# EAGLE design 2CH_Edgemount_POT (EAGLE 6.6.0)
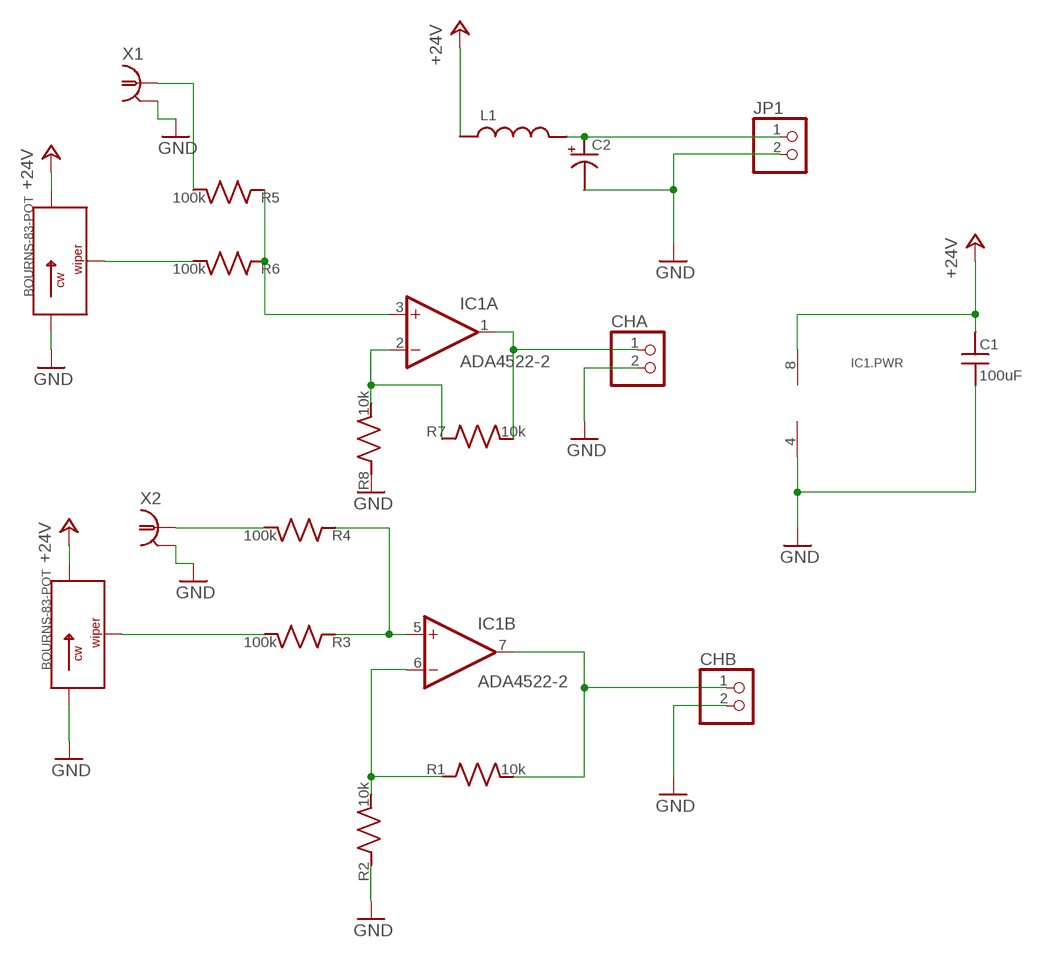
[diagram p0: schematic, sheet 1]

## Parts
C1  100uF  C_MLCC_SMDCMLCC_0603  [C_MLCC_0603]
C2  C_POL_SMDF  [PANASONIC_F]
CHA  PINHD-1X2  [1X02]
CHB  PINHD-1X2  [1X02]
IC1  ADA4522-2  [SO08]
JP1  PINHD-1X2  [1X02]
L1  L_FERRITE_SMDLFERRITE_0805  [R_0805]
R1  10k  R_SMDR1206  [R_1206]
R2  10k  R_SMDR1206  [R_1206]
R3  100k  R_SMDR1206  [R_1206]
R4  100k  R_SMDR1206  [R_1206]
R5  100k  R_SMDR1206  [R_1206]
R6  100k  R_SMDR1206  [R_1206]
R7  10k  R_SMDR1206  [R_1206]
R8  10k  R_SMDR1206  [R_1206]
R9  BOURNS-83-POT  [BOURNS83]
R10  BOURNS-83-POT  [BOURNS83]
X1  BNC-H  [BNC90]
X2  BNC-H  [BNC90]

## Nets
+24V: C1.P$1 IC1.8(.PWR:V+) L1.P$1 R9.P$3 R10.P$3
CHB: CHB.1 IC1.7(B:OUT) R1.P$2
GND: C1.P$2 C2.- CHA.2 CHB.2 IC1.4(.PWR:V-) JP1.2 R2.P$1 R8.P$1 R9.P$1 R10.P$1 X1.2 X2.2
N$1: R6.P$2 R9.P$2
N$2: R3.P$2 R10.P$2
N$3: IC1.6(B:-IN) R1.P$1 R2.P$2
N$4: IC1.5(B:+IN) R3.P$1 R4.P$1
N$5: IC1.2(A:-IN) R7.P$1 R8.P$2
N$6: CHA.1 IC1.1(A:OUT) R7.P$2
N$7: IC1.3(A:+IN) R5.P$1 R6.P$1
N$8: R4.P$2 X2.1
N$9: R5.P$2 X1.1
N$10: C2.+ JP1.1 L1.P$2

## Library data of the parts
C1 = jqi_passives:C_MLCC_SMD
C2 = jqi_passives:C_POL_SMD
CHA CHB JP1 = pinhead:PINHD-1X2: PIN HEADER
IC1 = opamp-jqi:ADA4522-2: 55V ultralow noise op amp
L1 = jqi_passives:L_FERRITE_SMD
R1-R8 = jqi_passives:R_SMD
R9 R10 = jqi_passives:BOURNS-83-POT: Through-hole POT
X1 X2 = connector-jqi:BNC: BNC Connector.; DIGIKEY: 12345

## Board
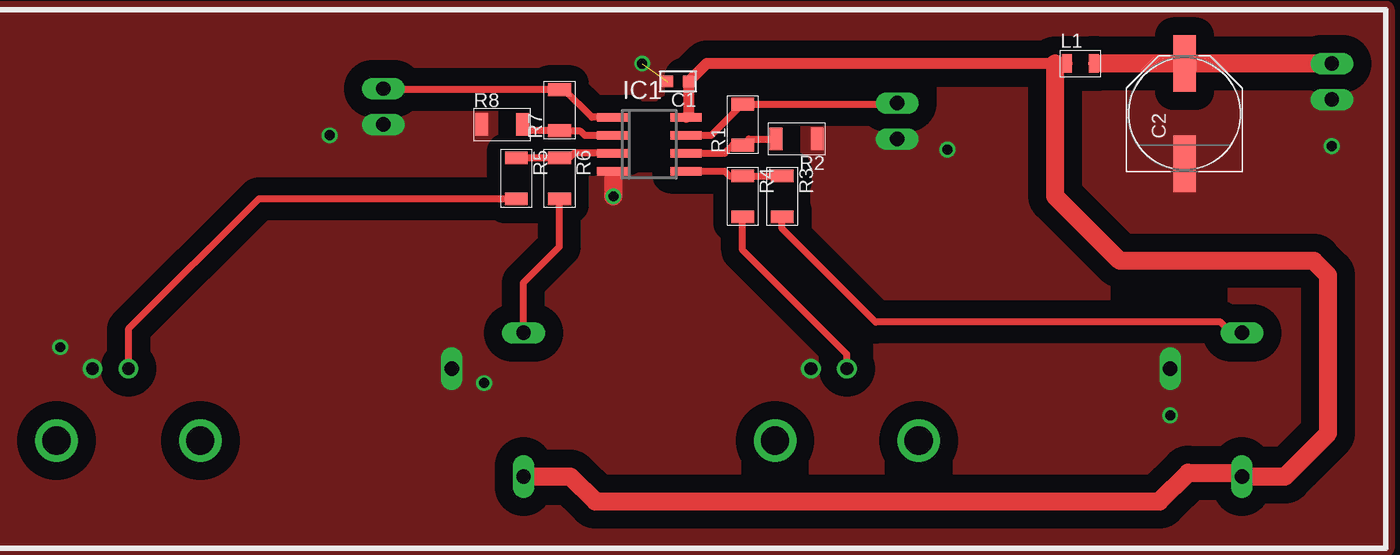
[diagram p1: board, top side]
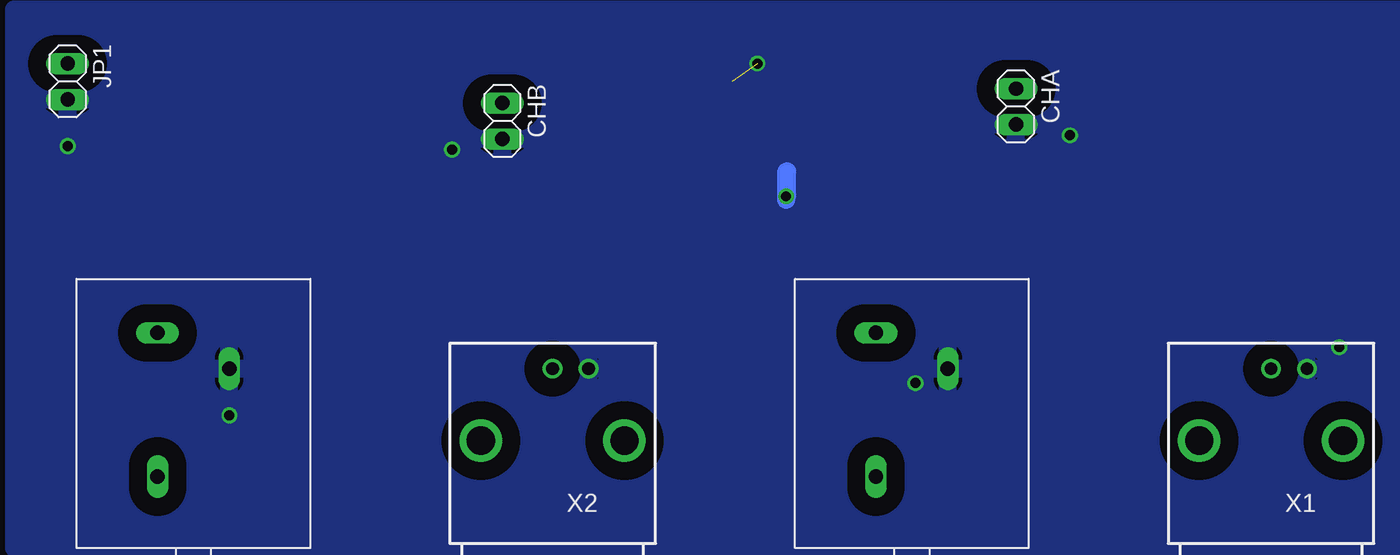
[diagram p2: board, bottom side, seen from below]

No outline drawn. Coordinates in mm, seen from the top.
Copper layers (1*16): Top 0.035mm / dielectric 1.5mm / Bottom 0.035mm
Design rules "default": minimum track width 10mil, minimum drill 24mil, track to track 8mil, track to pad 8mil, pad to pad 8mil, via to via 8mil, smd to smd 8mil, copper to edge 40mil, drill to drill 8mil, minimum pad ring 10mil, minimum via ring 8mil, stop-mask expansion 4mil, vias tented up to drill 0mil, thermal gap 10mil

### Footprints (pad centres in the part's own frame; a part is rotated, then mirrored left to right if it is on the bottom)
C_MLCC_0603 = smd 0.8 x 0.8: P$1 -0.75,0; P$2 0.75,0
PANASONIC_F = smd 4 x 1.6: + 3.55,0; - -3.55,0
1X02 = drill 1.016 long: 1 -1.27,0; 2 1.27,0
SO08 = smd 2.2 x 0.6: 1 -2.6,1.27; 2 -2.6,0; 3 -2.6,-1.27; 4 -2.6,-2.54; 5 2.6,-2.54; 6 2.6,-1.27; 7 2.6,0; 8 2.6,1.27
R_0805 = smd 0.7 x 1.3: P$1 -0.95,0; P$2 0.95,0
R_1206 = smd 0.9 x 1.6: P$1 -1.45,0; P$2 1.45,0
BOURNS83 = drill 1.016 long: P$1 2.54,2.54; P$2 -2.54,5.08; P$3 -2.54,-5.08
BNC90 = drill 0.9 pad 1.27: 1 0,-5.08; 2 -2.54,-5.08 | drill 2 pad 2.032: ANCHOR1 -5.08,0; ANCHOR2 5.08,0

### Placement (x,y rotation side)
C1  41.4,33.02 180 top
C2  77.22,30.73 90 top
CHA  20.57,31.24 270 bottom
CHB  56.9,30.23 270 bottom
IC1  39.37,29.21 0 top
JP1  87.63,33.02 270 bottom
L1  69.85,34.29 0 top
R1  45.97,29.97 90 top
R2  49.78,28.96 180 top
R3  48.77,24.89 270 top
R4  45.97,24.89 270 top
R5  29.97,26.16 270 top
R6  33.02,26.16 270 top
R7  33.02,30.99 90 top
R8  28.96,29.97 0 top
R9  27.94,10.16 0 bottom
R10  78.74,10.16 0 bottom
X1  2.54,7.62 180 bottom
X2  53.34,7.62 180 bottom

### Tracks (layer width: path | path; a pad name or v marks a point on that pad's centre or on a via)
+24V
  Top 0.762: IC1.8 42.15,30.66 C1.P$1 43.42,34.29 68.07,34.29 L1.P$1
  Top 1.27: R9.P$3 33.78,5.08 35.56,3.3 75.44,3.3 77.47,5.33 81.03,5.33 R10.P$3 84.33,5.08 87.38,8.13 87.38,19.3 86.36,20.32 72.64,20.32 68.07,24.89 68.07,34.29
CHB  (via drill 0.6)
  Top 0.508: IC1.7 43.76,29.21 R1.P$2 v56.82,31.42
  Bottom 0.508: v56.82,31.42 CHB.1
GND  (via drill 0.7)  (1 unrouted)
  Top 0.508: 36.83,26.16 36.83,26.61 arc90 IC1.4
  Top 1.27: v36.83,24.89 36.83,26.16
  Bottom 1.27: v36.83,24.89 36.77,24.95 IC1.4 36.83,26.61 36.83,24.64
  other vias: 16.76,29.21 60.45,28.19 87.63,28.45 76.2,9.4 27.69,11.68 38.86,34.29 -2.29,14.22
  pour Top (isolate 1.27, no thermals): -10.16,38.1 91.44,38.1 91.44,0 -10.16,0
  pour Bottom (isolate 1.27): -10.16,38.1 91.44,38.1 91.44,0 -10.16,0
N$1
  Top 0.508: R9.P$2 30.48,18.8 33.02,21.34 R6.P$2
N$2
  Top 0.508: R10.P$2 80.52,15.24 79.76,16 55.37,16 48.77,22.61 R3.P$2
N$3
  Top 0.508: R2.P$2 46.41,28.96 R1.P$1 45.29,28.52 44.7,27.94 IC1.6
N$4
  Top 0.508: IC1.5 44.7,26.67 45.03,26.34 R4.P$1 R3.P$1
N$5
  Top 0.508: R8.P$2 30.84,29.54 R7.P$1 34.47,29.54 34.8,29.21 IC1.2
N$6
  Top 0.508: IC1.1 35.31,30.48 33.35,32.44 R7.P$2 20.65,32.44 CHA.1
N$7
  Top 0.508: IC1.3 34.04,27.94 33.78,27.69 33.09,27.69 R6.P$1 R5.P$1
N$8
  Top 0.508: X2.1 53.34,13.72 45.97,21.08 R4.P$2
N$9
  Top 0.508: R5.P$2 11.76,24.71 2.54,15.49 X1.1
N$10
  Top 0.762: 71.37,34.29 L1.P$2
  Top 1.27: 71.37,34.29 71.37,34.28 76.71,34.28 C2.+ JP1.1